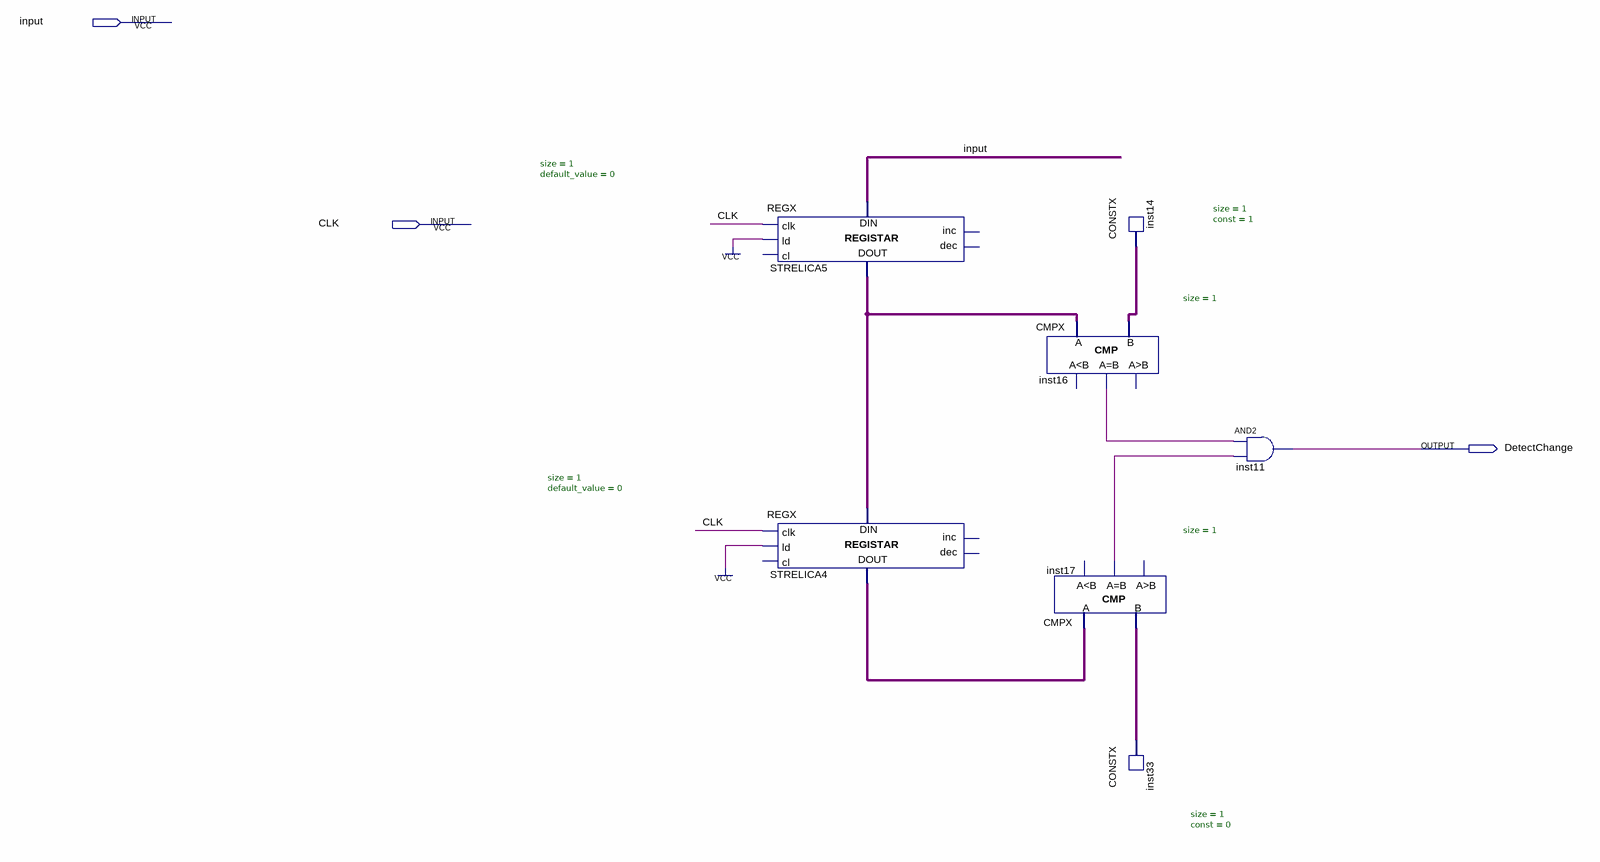
[diagram p0: schematic sheet]
// Quartus schematic DetectChange.bdf as structural Verilog: 7 symbols, 3 pins
module DetectChange (
  input  \input ,
  input  CLK,
  output DetectChange
);

  wire inst14_data, inst16_eq, inst17_eq, inst33_data, STRELICA4_data_out, STRELICA5_data_out;

  REGX #(.size(1), .default_value(0)) STRELICA5 (
    .clk(CLK), .ld(1'b1), .data_in(\input ), .data_out(STRELICA5_data_out));  // open: cl, inc, dec
  REGX #(.size(1), .default_value(0)) STRELICA4 (
    .clk(CLK), .ld(1'b1), .data_in(STRELICA5_data_out), .data_out(STRELICA4_data_out));  // open: cl, inc, dec
  CMPX #(.size(1)) inst16 (.A(STRELICA5_data_out), .B(inst14_data), .eq(inst16_eq));  // open: ls, gr
  CMPX #(.size(1)) inst17 (.A(STRELICA4_data_out), .B(inst33_data), .eq(inst17_eq));  // open: ls, gr
  CONSTX #(.size(1), .\const (1)) inst14 (.data(inst14_data));
  CONSTX #(.size(1), .\const (0)) inst33 (.data(inst33_data));
  and inst11 (DetectChange, inst16_eq, inst17_eq);
endmodule
